# EAGLE design LTC3108breakoutSSOC (EAGLE 6.1)
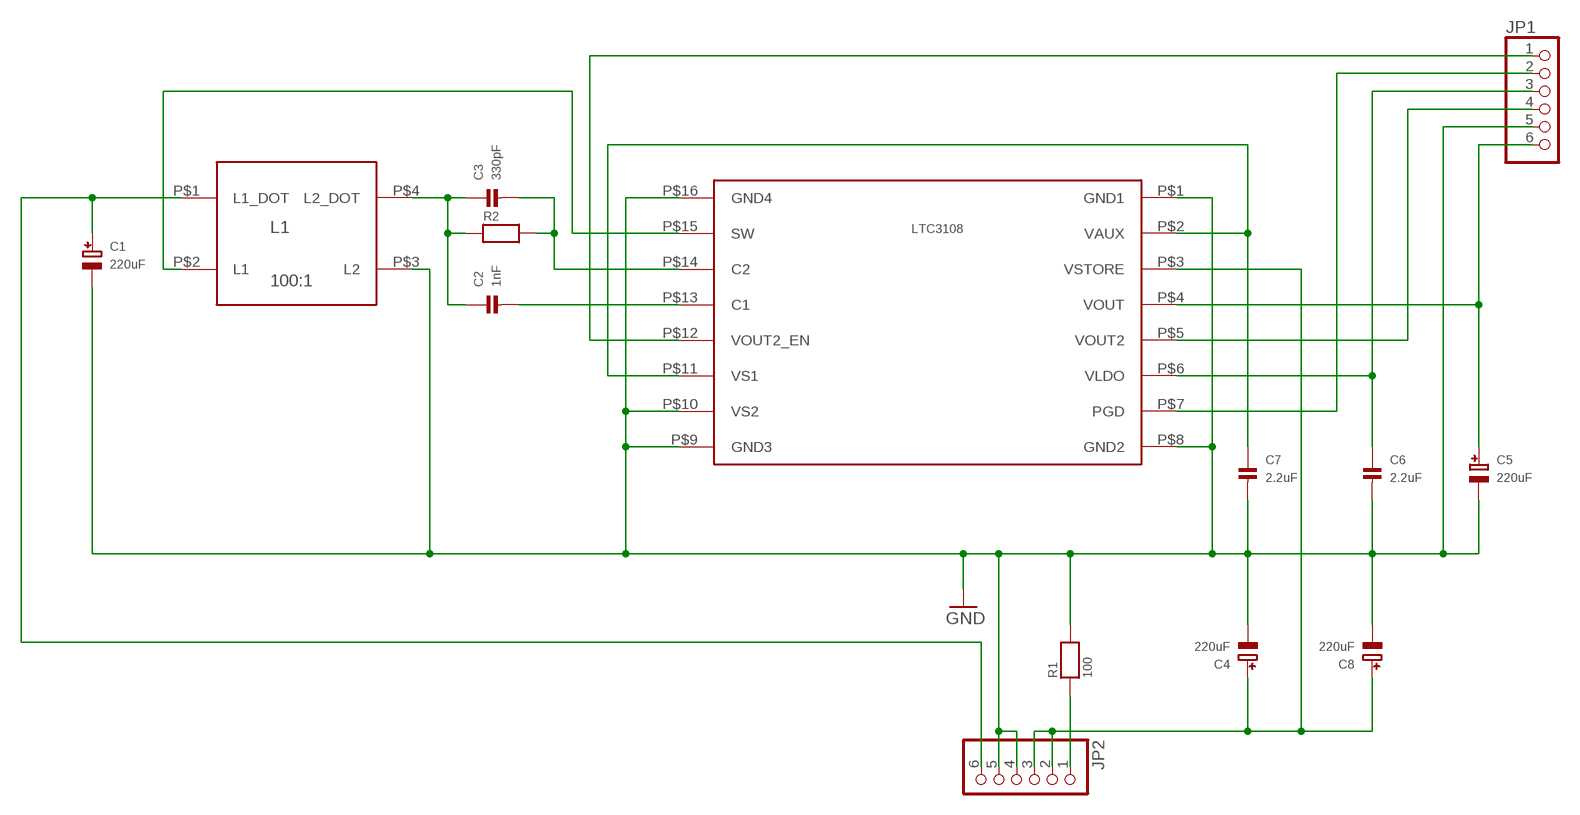
[diagram p0: schematic, sheet 1]

## Parts
C1  220uF  CAP_TANTALUMD/7343_REFLOW  [EIA7343-31/D-R]
C2  1nF  CAP_CERAMIC0603  [0603]
C3  330pF  CAP_CERAMIC0603  [0603]
C4  220uF  CAP_TANTALUMD/7343_REFLOW  [EIA7343-31/D-R]
C5  220uF  CAP_TANTALUMD/7343_REFLOW  [EIA7343-31/D-R]
C6  2.2uF  CAP_CERAMIC0603  [0603]
C7  2.2uF  CAP_CERAMIC0603  [0603]
C8  220uF  CAP_TANTALUMD/7343_REFLOW  [EIA7343-31/D-R]
JP1  HEADER-1X6ROUND  [1X06_ROUND]
JP2  HEADER-1X6ROUND  [1X06_ROUND]
L1  100:1  COILCRAFT_LPR6235-752SML  [COILCRAFT_LPR6235]
LTC3108  LTC3108-SSOP  [SSOP-GN-16]
R1  100  RESISTOR0603  [0603]
R2  RESISTOR0603  [0603]

## Nets
GND: C1.- C4.- C5.- C6.2 C7.2 C8.- JP1.5 JP2.4 JP2.5 L1.P$3(L2) LTC3108.P$1(GND1) LTC3108.P$8(GND2) LTC3108.P$9(GND3) LTC3108.P$10(VS2) LTC3108.P$16(GND4) R1.2
N$1: C1.+ JP2.6 L1.P$1(L1_DOT)
N$2: L1.P$2(L1) LTC3108.P$15(SW)
N$3: C3.2 LTC3108.P$14(C2) R2.2
N$4: C2.2 LTC3108.P$13(C1)
N$5: C2.1 C3.1 L1.P$4(L2_DOT) R2.1
N$6: C7.1 LTC3108.P$2(VAUX) LTC3108.P$11(VS1)
N$7: C4.+ C8.+ JP2.2 JP2.3 LTC3108.P$3(VSTORE)
N$8: C5.+ JP1.6 LTC3108.P$4(VOUT)
N$9: JP2.1 R1.1
N$10: C6.1 JP1.3 LTC3108.P$6(VLDO)
N$11: JP1.1 LTC3108.P$12(VOUT2_EN)
N$12: JP1.2 LTC3108.P$7(PGD)
N$13: JP1.4 LTC3108.P$5(VOUT2)

## Library data of the parts
C1 C4 C5 C8 = microbuilder:CAP_TANTALUM: Tantalum Capacitors Wave footprints have larger pads and are meant to be used for hand soldering. Reflow footprints are optimised for solder paste and a reflow oven. EIA3216-18/A-[R/W] - Size A / 3216-18 / 1206 footprint 4.7µF 25V 10% Tantalum Capacitor 10µF 16V 10% Tantalum Capacitor [Digikey: 495-2236-2-ND] EIA3528-21/B-[R/W] - Size B / 3528-21 47µF 10V 10% Tantalum Capactior [Digikey: 495-2216-1-ND] EIA6032-28/C-[R/W] - Size C / 6032-28 10µF 35V 20% Tantalum Capacitor [Digikey: 495-2285-1-ND] 100µF 16V 10% Tantalum Capactior [Digikey: 399-5214-1-ND]
C2 C3 C6 C7 = microbuilder:CAP_CERAMIC: Ceramic Capacitors 0402 - 0402 Surface Mount Capacitors 0.1uF 10V 10% [Digikey: 490-1318-2-ND] 0603 - 0603 Surface Mount Capacitors 16 pF 50V 5% [Digikey: 445-5051-2-ND] 22 pF 50V [Digikey: PCC220ACVTR-ND] 33 pF 50V 5% [Digikey: 490-1415-1-ND] 56pF 50V 5% [Digikey: 490-1421-1-ND] 220pF 50V 5% [Digikey: 445-1285-1-ND] 680 pF 50V 2200 pF 50V 5% C0G [Digikey: 445-1297-1-ND] 5600 pF 100V 5% X7R [Digikey: 478-3711-1-ND] 0.1 µF 25V 10% [Digikey: PCC2277TR-ND] 0.22 µF 16V 10% X7R [Digikey: 445-1318-1-ND] 1.0 µF 25V 10% [Digikey: 445-5146-2-ND] 0603 - RF Specific 3pF 250V +/-0.1pF RF [Digikey: 712-1347-1-ND] 18 pF 250V 5% [Digikey: 478-3505-1-ND or 712-1322-1-ND] 56 pF 250V 5% C0G RF [Digikey: 490-4867-1-ND] 68 pF 250V RF [Digikey: 490-4868-1-ND] 0805 - 0805 Surface Mount Capacitors 220 pF 250V 2% RF Ceramic Capacitor [Digikey: 712-1398-1-ND] 1000 pF 50V 2% NP0 Ceramic Capacitor [Digikey: 478-3760-1-ND] 0.1 µF 25V 10% Ceramic Capacitor [Digikey: PCC1828TR-ND] 1.0 µF 16V 10% Ceramic Capacitor[Digikey: 490-1691-2-ND] 10.0 µF 10V 10% Ceramic Capacitor[Digikey: 709-1228-1-ND] 1206 - 1206 Surface Mount Capacitors
JP1 JP2 = microbuilder:HEADER-1X6: PIN HEADER
L1 = wa7iut:COILCRAFT_LPR6235-752SML: Coil Craft LPR6235-752SML
LTC3108 = wa7iut:LTC3108-SSOP: LTC3108 in16 pin SSOP Narrow GN Package
R1 R2 = microbuilder:RESISTOR: Resistors 0402 - 0402 Surface Mount Package 10.0K 1% 1/16W [Digikey: 311-10.0KLRTR-ND] 0603 - 0603 Surface Mount Package 0 Ohm 1/10 Watt 1% Resistor 15 Ohm 1/10 Watt 1% Resistor 33 Ohm 1/10 Watt 1% Resistor 49.9 Ohm 1/10 Watt 1% Resistor 100 Ohm 1/10 Watt 1% Resistor 150 Ohm 1/10 Watt 1% Resistor 240 Ohm 1/10 Watt 1% Resistor 390 Ohm 1/10 Watt 1% Resistor 560 Ohm 1/10 Watt 1% Resistor 750 Ohm 1/10 Watt 1% Resistor 1.0K Ohm 1/10 Watt 1% Resistor 1.5K Ohm 1/10 Watt 1% Resistor 2.0K Ohm 1/10 Watt 1% Resistor 4.7K Ohm 1/10 Watt 1% Resistor 10.0K Ohm 1/10 Watt 1% Resistor 20.0K Ohm 1/10 Watt 1% Resistor 33.0K Ohm 1/10 Watt 1% Resistor 100.0K Ohm 1/10 Watt 1% Resistor 0805 - 0805 Surface Mount Package 0 Ohm 1/8 Watt 1% Resistor 33 Ohm 1/8 Watt 1% Resistor 100 Ohm 1/8 Watt 1% Resistor 150 Ohm 1/8 Watt 1% Resistor 200 Ohm 1/8 Watt 1% Resistor 240 Ohm 1/8 Watt 1% Resistor 330 Ohm 1/8 Watt 1% Resistor 390 Ohm 1/8 Watt 1% Resistor 470 Ohm 1/8 Watt 1% Resistor 1.0K Ohm 1/8 Watt 1% Resistor 1.5K Ohm 1/8 Watt 1% Resistor 2.0K Ohm 1/8 Watt 1% Resistor 4.7K Ohm 1/8 Watt 1% Resistor 5.1K Ohm 1/8 Watt 1% Resistor 5.6K Ohm 1/8 Watt 1% Resistor 10.0K Ohm 1/8 Watt 1% Resistor 22.0K Ohm 1/8 Watt 1% Resistor 33.0K Ohm 1/8 Watt 1% Resistor 100K Ohm 1/8 Watt 1% Resistor 1206 - 1206 Surface Mount Package

## Board
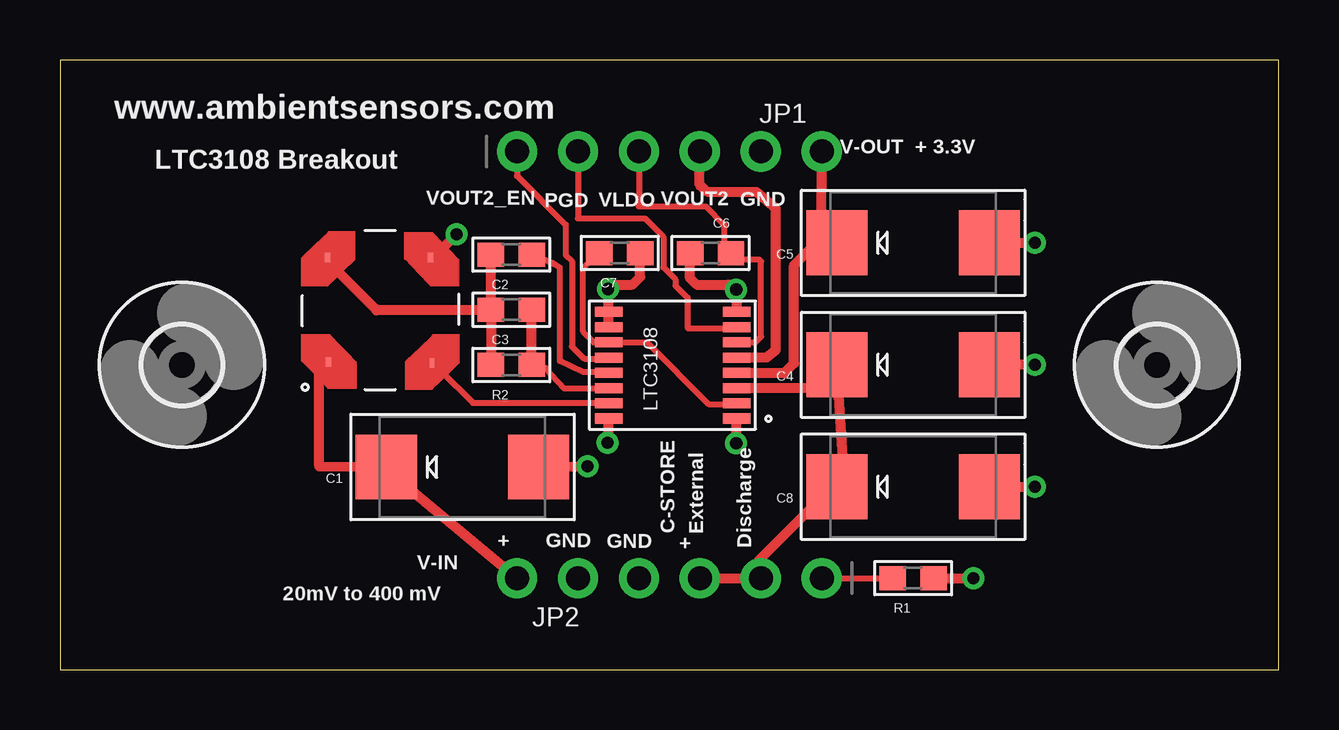
[diagram p1: board, top side]
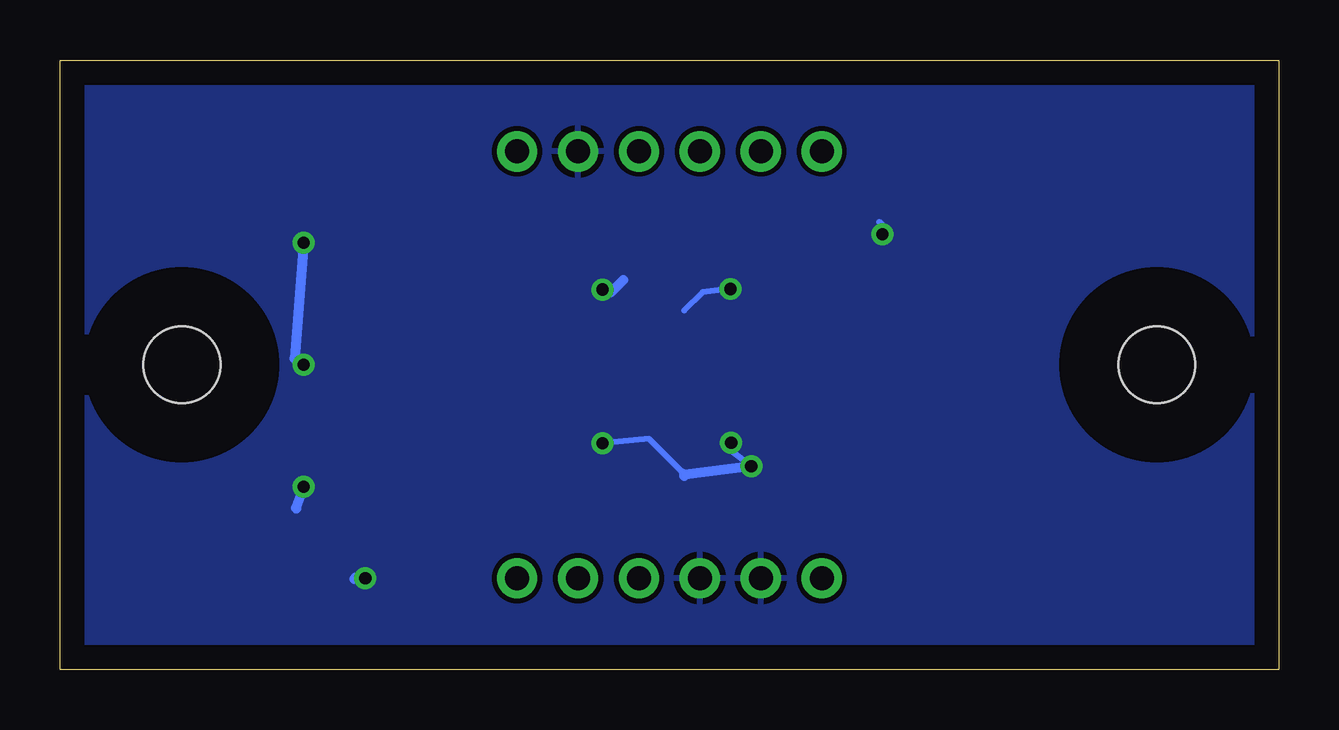
[diagram p2: board, bottom side, seen from below]

Size 50.8 x 25.4 mm. Coordinates in mm from the lower left corner, seen from the top.
Outline: 0,0 50.8,0 50.8,25.4 0,25.4 0,0
Copper layers (1*16): Top 0.035mm / dielectric 1.5mm / Bottom 0.035mm
Design rules: minimum track width 10mil, minimum drill 24mil, track to track 8mil, track to pad 8mil, pad to pad 8mil, via to via 8mil, smd to smd 8mil, copper to edge 40mil, drill to drill 8mil, minimum pad ring 10mil, minimum via ring 8mil, stop-mask expansion 4mil, vias tented up to drill 0mil, thermal gap 10mil

### Footprints (pad centres in the part's own frame; a part is rotated, then mirrored left to right if it is on the bottom)
EIA7343-31/D-R = smd 2.55 x 2.7: + 3.175,0; - -3.175,0
0603 = smd 1.1 x 1: 1 -0.85,0; 2 0.85,0
1X06_ROUND = drill 1 pad 1.676: 1 -6.35,0; 2 -3.81,0; 3 -1.27,0; 4 1.27,0; 5 3.81,0; 6 6.35,0
COILCRAFT_LPR6235 = smd 0.406 x 0.203: P$1 -2.15,2.15; P$2 -2.2,-2.15; P$3 2.2,-2.1; P$4 2.2,2.2
SSOP-GN-16 = smd 0.419 x 1.143: P$1 -2.222,-2.662; P$2 -1.587,-2.662; P$3 -0.952,-2.662; P$4 -0.317,-2.662; P$5 0.318,-2.662; P$6 0.953,-2.662; P$7 1.588,-2.662; P$8 2.223,-2.662; P$9 2.223,2.67; P$10 1.587,2.67; P$11 0.953,2.67; P$12 0.318,2.67; P$13 -0.318,2.67; P$14 -0.953,2.67; P$15 -1.587,2.67; P$16 -2.223,2.67
MOUNTINGHOLE_3.2 = hole 3.2: 0,0

### Placement (x,y rotation side)
C1  16.78,8.44 180 top
C2  18.81,17.29 0 top
C3  18.81,15 0 top
C4  35.56,12.7 180 top
C5  35.56,17.78 180 top
C6  27.12,17.36 180 top
C7  23.33,17.36 0 top
C8  35.56,7.62 180 top
JP1  25.4,21.59 0 top
JP2  25.4,3.81 180 top
L1  13.35,14.97 90 top
LTC3108  25.54,12.68 90 top
R1  35.56,3.81 0 top
R2  18.81,12.69 0 top
U$2  [MOUNTINGHOLE_3.2]  5.08,12.7 0 top
U$3  [MOUNTINGHOLE_3.2]  45.72,12.7 0 top

### Tracks (layer width: path | path; a pad name or v marks a point on that pad's centre or on a via)
GND  (via drill 0.51)
  Top 0.254: L1.P$3 15.55,17.17 | v21.99,8.47 22.06,8.67 | 22.87,15.78 v22.85,15.86 | v28.18,15.83 28.2,15.69 | 38.81,12.7 C4.-
  Top 0.406: 15.55,17.17 v16.52,18.14 | C1.- v21.99,8.47 | LTC3108.P$16 22.87,9.69 v22.82,9.46 | LTC3108.P$1 28.2,9.66 v28.18,9.43 | 22.87,15.78 LTC3108.P$9 LTC3108.P$10 | 28.2,15.69 LTC3108.P$8 | C6.2 26.27,16.3 26.53,16.04 27.85,16.04 v28.18,15.83 | C7.2 24.18,16.35 23.87,16.04 23.03,16.04 v22.85,15.86 | C5.- v40.64,17.78 | v40.64,12.7 38.81,12.7 38.76,12.65 | C8.- v40.64,7.62 | R1.2 v38.08,3.81
  Bottom 0.254: v16.52,18.14 16.52,18.53 16.65,18.65 | v22.82,9.46 22.82,9.13 v21.99,8.47 | v28.18,9.43 26.24,9.61 24.86,8.23 | v22.85,15.86 24.02,15.73 24.78,14.97
  Bottom 0.305: 24.74,8.11 24.86,8.23
  Bottom 0.406: v21.99,8.47 24.74,8.11 24.78,8.07 | v28.18,15.83 27.85,15.71 27.32,16.24 | v40.64,17.78 41.02,12.95 v40.64,12.7 | v40.64,7.62 40.97,6.73 40.95,6.71 | v38.08,3.81 38.48,3.83 38.53,3.79
  pour Bottom: 0,25 0,0 50,0 50,25
N$1
  Top 0.254: C1.+ 13.71,8.26
  Top 0.406: L1.P$1 11.2,12.77 10.81,12.38 10.81,8.47 C1.+ | 13.71,8.26 JP2.6
N$2
  Top 0.254: L1.P$2 15.82,12.45 15.87,12.45 17.21,11.11 LTC3108.P$15
N$3
  Top 0.254: LTC3108.P$14 22.86,11.72 21.02,11.72 20.25,12.56 20.27,12.53 R2.2
  Top 0.406: R2.2 C3.2
N$4
  Top 0.254: LTC3108.P$13 22.83,12.4 21.81,12.4 20.84,12.86 20.84,16.75 20.57,16.91 C2.2
N$5
  Top 0.254: 13.2,14.97 13.22,14.99 | L1.P$4 11.57,16.75
  Top 0.406: 13.2,14.97 11.57,16.6 11.57,16.75 | C3.1 R2.1 | C3.1 C2.1 | 13.22,14.99 C3.1
N$6
  Top 0.254: C7.1 22.38,17.3 21.81,16.72 21.81,14.08 22.25,13.64 LTC3108.P$11 24.46,13.64 27.04,11.06 28.17,11.06 LTC3108.P$2
N$7
  Top 0.254: C8.+ 31.51,6.97 | 32.44,6.38 32.44,6.87 C8.+ | C4.+ 31.98,11.73 | C8.+ 32.73,7.22 | JP2.2 29.13,3.81 | 31.47,6.88 31.5,6.86 C8.+
  Top 0.406: 31.98,11.73 LTC3108.P$3 | 32.73,7.22 C4.+ | JP2.3 29.13,3.81 29.13,4.55 31.47,6.88 31.55,6.96
N$8
  Top 0.254: 31.64,17.89 C5.+
  Top 0.406: LTC3108.P$4 30.2,12.37 30.6,12.76 30.6,16.85 31.64,17.89 | JP1.6 31.74,18.25 C5.+
N$9
  Top 0.254: JP2.1 R1.1
N$10
  Top 0.254: LTC3108.P$6 28.98,13.64 29.23,13.88 29.23,17 29.15,17.08 28.25,17.08 C6.1 27.94,17.27 27.69,17.27 27.69,18.54 26.92,19.3 24.13,19.3 JP1.3
N$11
  Top 0.254: JP1.1 19.05,20.57 21.08,18.54 21.08,17.27 21.34,17.02 21.34,13.46 21.84,12.95 22.86,12.95 LTC3108.P$12
N$12
  Top 0.254: JP1.2 21.59,18.8 24.38,18.8 25.15,18.03 25.15,16.76 25.65,16.26 25.65,16 26.16,15.49 26.16,14.22 28.19,14.22 LTC3108.P$7
N$13
  Top 0.406: JP1.4 26.66,20.2 27.02,19.9 29.02,19.9 29.84,19.21 29.84,13.32 29.45,13.01 28.22,13.01 LTC3108.P$5

### Text on the board
tPlace: www.ambientsensors.com | LTC3108 Breakout | V-OUT + 3.3V | VOUT2_EN | PGD | VLDO | VOUT2 | GND | C-STORE | External | + | GND | GND | + | Discharge | V-IN | 20mV to 400 mV